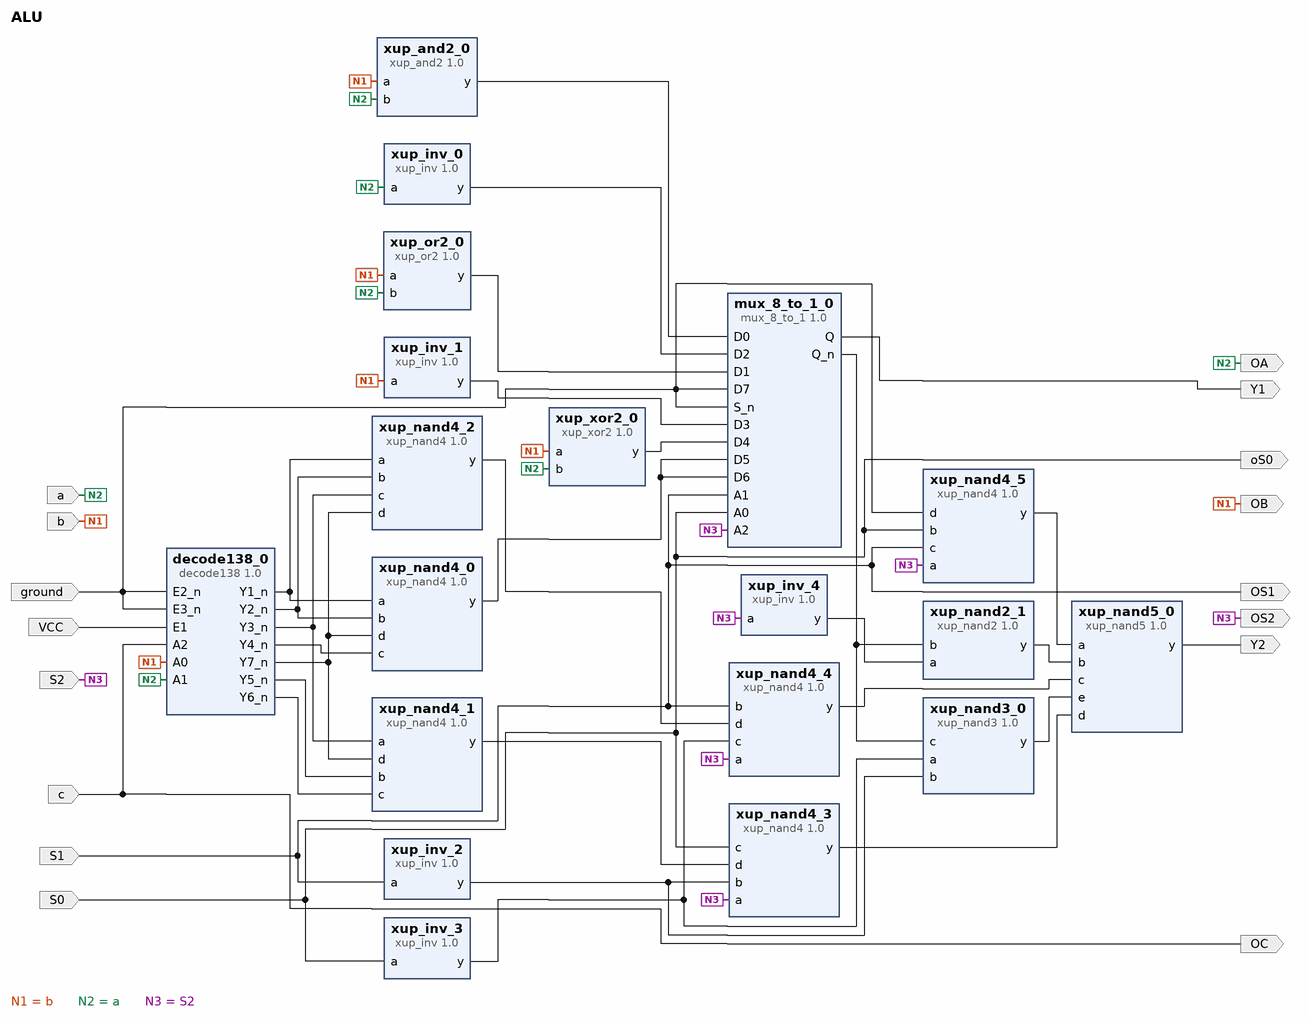
[diagram p0: block diagram of the top level]
# Vivado block design ALU, xc7a35tcpg236-1, Vivado 2016.4
create_bd_design ALU

create_bd_port -dir I b
create_bd_port -dir O OB
create_bd_port -dir I a
create_bd_port -dir O OA
create_bd_port -dir I c
create_bd_port -dir O OC
create_bd_port -dir I ground
create_bd_port -dir I VCC
create_bd_port -dir I S0
create_bd_port -dir O oS0
create_bd_port -dir I S1
create_bd_port -dir O OS1
create_bd_port -dir I S2
create_bd_port -dir O OS2
create_bd_port -dir O Y1
create_bd_port -dir O Y2

create_bd_cell -type ip -vlnv xilinx.com:xup:xup_and2:1.0 xup_and2_0
create_bd_cell -type ip -vlnv xilinx.com:xup:xup_inv:1.0 xup_inv_0
create_bd_cell -type ip -vlnv xilinx.com:xup:xup_inv:1.0 xup_inv_1
create_bd_cell -type ip -vlnv xilinx.com:xup:xup_or2:1.0 xup_or2_0
create_bd_cell -type ip -vlnv xilinx.com:xup:xup_xor2:1.0 xup_xor2_0
create_bd_cell -type ip -vlnv xilinx.com:xup:mux_8_to_1:1.0 mux_8_to_1_0
create_bd_cell -type ip -vlnv xilinx.com:XUP:decode138:1.0 decode138_0
create_bd_cell -type ip -vlnv xilinx.com:xup:xup_nand4:1.0 xup_nand4_0
create_bd_cell -type ip -vlnv xilinx.com:xup:xup_nand4:1.0 xup_nand4_1
create_bd_cell -type ip -vlnv xilinx.com:xup:xup_nand4:1.0 xup_nand4_2
create_bd_cell -type ip -vlnv xilinx.com:xup:xup_inv:1.0 xup_inv_2
create_bd_cell -type ip -vlnv xilinx.com:xup:xup_inv:1.0 xup_inv_3
create_bd_cell -type ip -vlnv xilinx.com:xup:xup_nand4:1.0 xup_nand4_3
create_bd_cell -type ip -vlnv xilinx.com:xup:xup_nand4:1.0 xup_nand4_4
create_bd_cell -type ip -vlnv xilinx.com:xup:xup_inv:1.0 xup_inv_4
create_bd_cell -type ip -vlnv xilinx.com:xup:xup_nand2:1.0 xup_nand2_1
create_bd_cell -type ip -vlnv xilinx.com:xup:xup_nand3:1.0 xup_nand3_0
create_bd_cell -type ip -vlnv xilinx.com:xup:xup_nand4:1.0 xup_nand4_5
create_bd_cell -type ip -vlnv xilinx.com:xup:xup_nand5:1.0 xup_nand5_0

# ---- connections ----

connect_bd_net [get_bd_ports b] \
  [get_bd_ports OB] [get_bd_pins xup_and2_0/a] [get_bd_pins xup_or2_0/a] [get_bd_pins xup_inv_1/a] [get_bd_pins xup_xor2_0/a] \
  [get_bd_pins decode138_0/A0]
connect_bd_net [get_bd_ports a] \
  [get_bd_ports OA] [get_bd_pins xup_and2_0/b] [get_bd_pins xup_or2_0/b] [get_bd_pins xup_inv_0/a] [get_bd_pins xup_xor2_0/b] \
  [get_bd_pins decode138_0/A1]
connect_bd_net [get_bd_pins xup_and2_0/y] [get_bd_pins mux_8_to_1_0/D0]
connect_bd_net [get_bd_pins xup_or2_0/y] [get_bd_pins mux_8_to_1_0/D1]
connect_bd_net [get_bd_pins xup_inv_0/y] [get_bd_pins mux_8_to_1_0/D2]
connect_bd_net [get_bd_pins xup_inv_1/y] [get_bd_pins mux_8_to_1_0/D3]
connect_bd_net [get_bd_pins xup_xor2_0/y] [get_bd_pins mux_8_to_1_0/D4]
connect_bd_net [get_bd_ports c] [get_bd_ports OC] [get_bd_pins decode138_0/A2]
connect_bd_net [get_bd_ports ground] \
  [get_bd_pins decode138_0/E2_n] [get_bd_pins decode138_0/E3_n] [get_bd_pins mux_8_to_1_0/S_n] [get_bd_pins mux_8_to_1_0/D7] \
  [get_bd_pins xup_nand4_5/d]
connect_bd_net [get_bd_ports VCC] [get_bd_pins decode138_0/E1]
connect_bd_net -net S0_1 [get_bd_ports S0] \
  [get_bd_ports oS0] [get_bd_pins mux_8_to_1_0/A0] [get_bd_pins xup_inv_3/a] [get_bd_pins xup_nand4_3/c] \
  [get_bd_pins xup_nand4_5/b]
connect_bd_net -net S1_1 [get_bd_ports S1] \
  [get_bd_ports OS1] [get_bd_pins mux_8_to_1_0/A1] [get_bd_pins xup_inv_2/a] [get_bd_pins xup_nand4_4/b] \
  [get_bd_pins xup_nand4_5/c]
connect_bd_net -net S2_1 [get_bd_ports S2] \
  [get_bd_ports OS2] [get_bd_pins mux_8_to_1_0/A2] [get_bd_pins xup_nand4_3/a] [get_bd_pins xup_nand4_4/a] \
  [get_bd_pins xup_inv_4/a] [get_bd_pins xup_nand4_5/a]
connect_bd_net [get_bd_pins decode138_0/Y1_n] [get_bd_pins xup_nand4_0/a] [get_bd_pins xup_nand4_2/a]
connect_bd_net [get_bd_pins decode138_0/Y2_n] [get_bd_pins xup_nand4_0/b] [get_bd_pins xup_nand4_2/b]
connect_bd_net [get_bd_pins decode138_0/Y4_n] [get_bd_pins xup_nand4_0/c]
connect_bd_net [get_bd_pins decode138_0/Y7_n] [get_bd_pins xup_nand4_0/d] [get_bd_pins xup_nand4_1/d] [get_bd_pins xup_nand4_2/d]
connect_bd_net [get_bd_pins decode138_0/Y3_n] [get_bd_pins xup_nand4_1/a] [get_bd_pins xup_nand4_2/c]
connect_bd_net [get_bd_pins decode138_0/Y5_n] [get_bd_pins xup_nand4_1/b]
connect_bd_net [get_bd_pins decode138_0/Y6_n] [get_bd_pins xup_nand4_1/c]
connect_bd_net [get_bd_pins xup_nand4_0/y] [get_bd_pins mux_8_to_1_0/D5] [get_bd_pins mux_8_to_1_0/D6]
connect_bd_net [get_bd_pins xup_inv_2/y] [get_bd_pins xup_nand4_3/b] [get_bd_pins xup_nand3_0/b]
connect_bd_net [get_bd_pins xup_nand4_1/y] [get_bd_pins xup_nand4_3/d]
connect_bd_net [get_bd_pins xup_inv_3/y] [get_bd_pins xup_nand4_4/c] [get_bd_pins xup_nand3_0/a]
connect_bd_net [get_bd_pins xup_nand4_2/y] [get_bd_pins xup_nand4_4/d]
connect_bd_net [get_bd_pins xup_inv_4/y] [get_bd_pins xup_nand2_1/a]
connect_bd_net [get_bd_pins mux_8_to_1_0/Q_n] [get_bd_pins xup_nand2_1/b] [get_bd_pins xup_nand3_0/c]
connect_bd_net [get_bd_pins mux_8_to_1_0/Q] [get_bd_ports Y1]
connect_bd_net [get_bd_pins xup_nand4_5/y] [get_bd_pins xup_nand5_0/a]
connect_bd_net [get_bd_pins xup_nand2_1/y] [get_bd_pins xup_nand5_0/b]
connect_bd_net [get_bd_pins xup_nand4_4/y] [get_bd_pins xup_nand5_0/c]
connect_bd_net [get_bd_pins xup_nand4_3/y] [get_bd_pins xup_nand5_0/d]
connect_bd_net [get_bd_pins xup_nand3_0/y] [get_bd_pins xup_nand5_0/e]
connect_bd_net [get_bd_pins xup_nand5_0/y] [get_bd_ports Y2]

validate_bd_design
save_bd_design
